# Altium project JEM_HotWater_Cntrl.PrjPCB
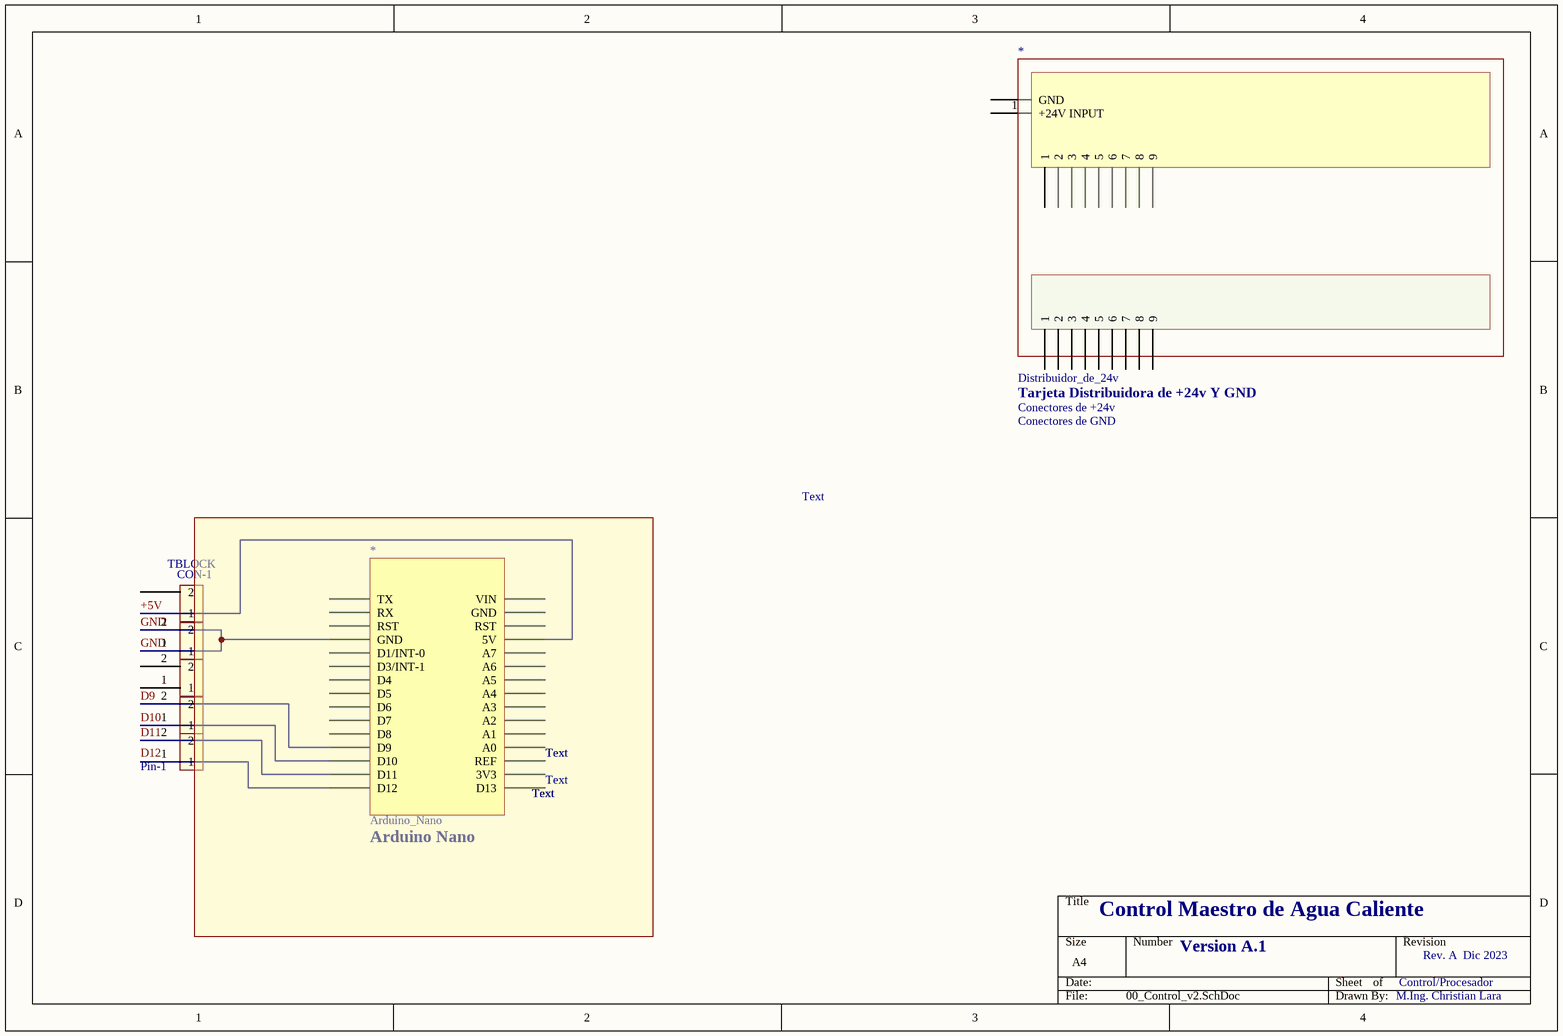
[diagram p0: 00_Control_v2.SchDoc]
1 sheet, 7 parts. Net scope: global (net labels, ports and power ports of the same name join across sheets).

## Sheet 00_Control_v2.SchDoc
size A4

### Parts
(Parts that share a designator on the sheet are numbered #1, #2 ... from top to bottom, then left to right.)
*#1  Distribuidor_de_24v  Description: Tarjeta Distribuidora de +24v Y GND
*#2  Arduino_Nano  Description: Arduino Nano
TB?#1  value CON-1  [TBLOCK-2POS-5.08MM-35°]  (hidden comment: 5.08mm 135°  26-12AWG TBlock 2Pos Verd)
TB?#2  5.08mm 135°  26-12AWG TBlock 2Pos Verd  [TBLOCK-2POS-5.08MM-35°]  (value not drawn)
TB?#3  5.08mm 135°  26-12AWG TBlock 2Pos Verd  [TBLOCK-2POS-5.08MM-35°]  (value not drawn)
TB?#4  5.08mm 135°  26-12AWG TBlock 2Pos Verd  [TBLOCK-2POS-5.08MM-35°]  (value not drawn)
TB?#5  5.08mm 135°  26-12AWG TBlock 2Pos Verd  [TBLOCK-2POS-5.08MM-35°]  (value not drawn)

### Nets
+5V: *#2.24(5V) TB?#1.1
D9: *#2.9(D9) TB?#4.2
D10: *#2.10(D10) TB?#4.1
D11: *#2.11(D11) TB?#5.2
GND: *#2.1(GND) TB?#2.1 TB?#2.2
Net*#2_12: *#2.12(D12) TB?#5.1

Not connected (* = marked no-connect by the designer): *#1 0(GND) 1(+24V_INPUT) 2 3 4 5 6 7 8 9 29(1); *#2 0(RST) 00(RX) 000(TX) 2(D1/INT-0) 3(D3/INT-1) 4(D4) 5(D5) 6(D6) 7(D7) 8(D8) 13(D13) 14(3V3) 15(REF) 16(A0) 17(A1) 18(A2) 19(A3) 20(A4) 21(A5) 22(A6) 23(A7) 25(RST) 26(GND) 27(VIN); TB?#1 2; TB?#3 1 2

### Notes on the sheet
- Text
- (near TB?#5) Pin-1
- (near *#2) Text
- Control Maestro de Agua Caliente
- Version A.1
- Control/Procesador
- Rev. A  Dic 2023
- M.Ing. Christian Lara
- Labels drawn without touching a wire or pin: D12
- (in symbol Distribuidor_de_24v) Conectores de +24v; Conectores de GND
- (in symbol TBlock 2Pos Verd) TBLOCK

### Library data of the parts
*#1 = Distribuidor_de_24v: Distribuye +24v & GND
TB?#1 = TBlock 2Pos Verd: PartNumber: MC24372; Description: MULTICOMP  MC24372  TERMINAL BLOCK EUROSTYLE, 3POS, 26-12AWG; SupplierPN: 14N5701; Pricing: 1.08; Supplier: Newark
TB?#2-TB?#5 = TBlock 2Pos Verd: PartNumber: MC24372; Description: MULTICOMP  MC24372  TERMINAL BLOCK EUROSTYLE, 3POS, 26-12AWG; Value: 2-TBlock-5.08mm; SupplierPN: 14N5701; Pricing: 1.08; Supplier: Newark